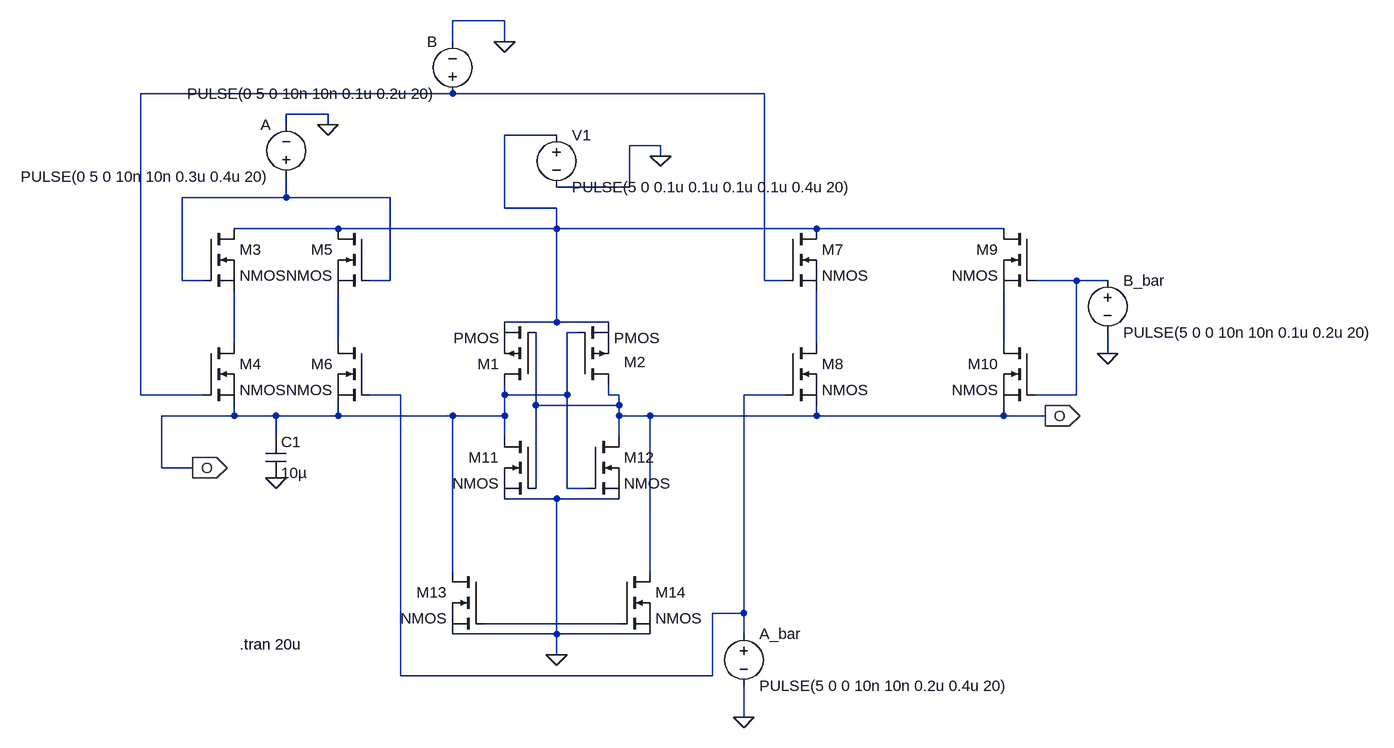
[diagram p0: schematic AND _EESPFAL_Wathore.asc]
AND _EESPFAL_Wathore.asc, the LTspice schematic file:
Version 4
SHEET 1 1808 740
WIRE 400 -352 320 -352
WIRE 320 -320 320 -352
WIRE 400 -320 400 -352
WIRE 320 -240 -160 -240
WIRE 800 -240 320 -240
WIRE 128 -208 64 -208
WIRE 64 -192 64 -208
WIRE 128 -192 128 -208
WIRE 480 -176 400 -176
WIRE 640 -160 592 -160
WIRE 640 -144 640 -160
WIRE 592 -96 592 -160
WIRE 592 -96 480 -96
WIRE 64 -80 64 -112
WIRE 64 -80 -96 -80
WIRE 224 -80 64 -80
WIRE 400 -64 400 -176
WIRE 480 -64 400 -64
WIRE 144 -32 -16 -32
WIRE 480 -32 480 -64
WIRE 480 -32 144 -32
WIRE 880 -32 480 -32
WIRE 1168 -32 880 -32
WIRE -96 48 -96 -80
WIRE -64 48 -96 48
WIRE 224 48 224 -80
WIRE 224 48 192 48
WIRE 800 48 800 -240
WIRE 832 48 800 48
WIRE 1280 48 1216 48
WIRE 1328 48 1280 48
WIRE 480 112 480 -32
WIRE 480 112 400 112
WIRE 560 112 480 112
WIRE 512 128 496 128
WIRE -16 144 -16 64
WIRE 144 144 144 64
WIRE 880 144 880 64
WIRE 1168 144 1168 64
WIRE 1328 160 1328 128
WIRE -160 224 -160 -240
WIRE -64 224 -160 224
WIRE 240 224 192 224
WIRE 400 224 400 208
WIRE 496 224 496 128
WIRE 496 224 400 224
WIRE 560 224 560 208
WIRE 576 224 560 224
WIRE 832 224 768 224
WIRE 1280 224 1280 48
WIRE 1280 224 1216 224
WIRE 448 240 448 128
WIRE 576 240 576 224
WIRE 576 240 448 240
WIRE -16 256 -16 240
WIRE -16 256 -128 256
WIRE 48 256 -16 256
WIRE 144 256 144 240
WIRE 144 256 48 256
WIRE 320 256 144 256
WIRE 400 256 400 224
WIRE 400 256 320 256
WIRE 576 256 576 240
WIRE 624 256 576 256
WIRE 880 256 880 240
WIRE 880 256 624 256
WIRE 1168 256 1168 240
WIRE 1168 256 880 256
WIRE 1232 256 1168 256
WIRE 48 288 48 256
WIRE 400 288 400 256
WIRE 576 288 576 256
WIRE -128 336 -128 256
WIRE -80 336 -128 336
WIRE 448 368 448 240
WIRE 496 368 496 224
WIRE 528 368 496 368
WIRE 480 384 400 384
WIRE 576 384 480 384
WIRE 320 496 320 256
WIRE 624 496 624 256
WIRE 768 560 768 224
WIRE 768 560 720 560
WIRE 576 576 368 576
WIRE 480 592 480 384
WIRE 480 592 320 592
WIRE 624 592 480 592
WIRE 768 592 768 560
WIRE 480 624 480 592
WIRE 240 656 240 224
WIRE 720 656 720 560
WIRE 720 656 240 656
WIRE 768 720 768 672
FLAG 480 624 0
FLAG 640 -144 0
FLAG 128 -192 0
FLAG 400 -320 0
FLAG 1328 160 0
FLAG 768 720 0
FLAG 1232 256 O
IOPIN 1232 256 Out
FLAG -80 336 O
IOPIN -80 336 Out
FLAG 48 352 0
SYMBOL pmos 512 208 M180
WINDOW 0 72 35 Left 2
SYMATTR InstName M2
SYMBOL nmos -64 -32 R0
SYMATTR InstName M3
SYMBOL nmos -64 144 R0
SYMATTR InstName M4
SYMBOL nmos 192 -32 M0
SYMATTR InstName M5
SYMBOL nmos 192 144 M0
SYMATTR InstName M6
SYMBOL nmos 832 -32 R0
SYMATTR InstName M7
SYMBOL nmos 832 144 R0
SYMATTR InstName M8
SYMBOL nmos 1216 -32 M0
SYMATTR InstName M9
SYMBOL nmos 1216 144 M0
SYMATTR InstName M10
SYMBOL nmos 448 288 M0
SYMATTR InstName M11
SYMBOL nmos 528 288 R0
SYMATTR InstName M12
SYMBOL nmos 368 496 M0
SYMATTR InstName M13
SYMBOL pmos 448 208 R180
SYMATTR InstName M1
SYMBOL nmos 576 496 R0
SYMATTR InstName M14
SYMBOL voltage 480 -192 R0
WINDOW 123 0 0 Left 0
WINDOW 39 0 0 Left 0
SYMATTR InstName V1
SYMATTR Value PULSE(5 0 0.1u 0.1u 0.1u 0.1u 0.4u 20)
SYMBOL voltage 320 -224 R180
WINDOW 0 24 96 Left 2
WINDOW 3 24 16 Left 2
WINDOW 123 0 0 Left 0
WINDOW 39 0 0 Left 0
SYMATTR InstName B
SYMATTR Value PULSE(0 5 0 10n 10n 0.1u 0.2u 20)
SYMBOL voltage 64 -96 R180
WINDOW 0 24 96 Left 2
WINDOW 3 24 16 Left 2
WINDOW 123 0 0 Left 0
WINDOW 39 0 0 Left 0
SYMATTR InstName A
SYMATTR Value PULSE(0 5 0 10n 10n 0.3u 0.4u 20)
SYMBOL voltage 768 576 R0
WINDOW 123 0 0 Left 0
WINDOW 39 0 0 Left 0
SYMATTR InstName A_bar
SYMATTR Value PULSE(5 0 0 10n 10n 0.2u 0.4u 20)
SYMBOL voltage 1328 32 R0
WINDOW 123 0 0 Left 0
WINDOW 39 0 0 Left 0
SYMATTR InstName B_bar
SYMATTR Value PULSE(5 0 0 10n 10n 0.1u 0.2u 20)
SYMBOL cap 32 288 R0
SYMATTR InstName C1
SYMATTR Value 10µ
TEXT -8 608 Left 2 !.tran 20u

The netlist it stands for:
* AND _EESPFAL_Wathore.asc
M2 O O N002 N002 PMOS
M3 N002 N003 N005 N005 NMOS
M4 N005 N001 O O NMOS
M5 N002 N003 N006 N006 NMOS
M6 N006 N009 O O NMOS
M7 N002 N001 N007 N007 NMOS
M8 N007 N009 O O NMOS
M9 N002 N004 N008 N008 NMOS
M10 N008 N004 O O NMOS
M11 O O 0 0 NMOS
M12 O O 0 0 NMOS
M13 O N010 0 0 NMOS
M1 O O N002 N002 PMOS
M14 O N010 0 0 NMOS
V1 N002 0 PULSE(5 0 0.1u 0.1u 0.1u 0.1u 0.4u 20)
V§B N001 0 PULSE(0 5 0 10n 10n 0.1u 0.2u 20)
V§A N003 0 PULSE(0 5 0 10n 10n 0.3u 0.4u 20)
V§A_bar N009 0 PULSE(5 0 0 10n 10n 0.2u 0.4u 20)
V§B_bar N004 0 PULSE(5 0 0 10n 10n 0.1u 0.2u 20)
C1 O 0 10µ
.model NMOS NMOS
.model PMOS PMOS
.lib standard.mos
.tran 20u
.backanno
.end